# Altium schematic sheet Piksi.SchDoc
size B
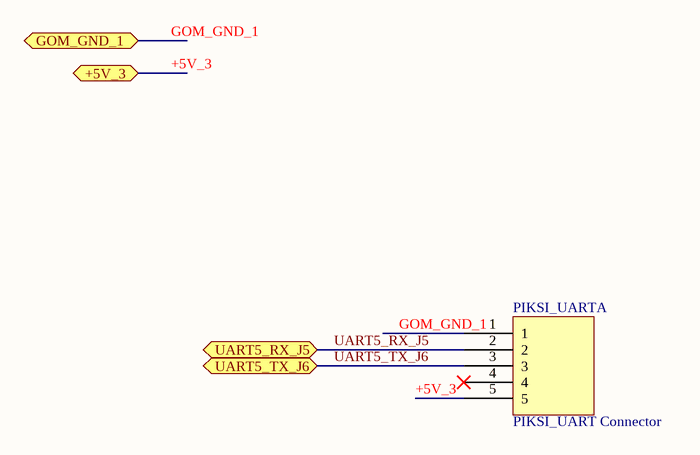
[diagram p0: Piksi.SchDoc]

## Parts
PIKSI_UARTA  PIKSI_UART Connector  [Molex Picoblade 5 Pin]

## Ports
+5V_3 (bidir), GOM_GND_1 (bidir), UART5_RX_J5 (bidir), UART5_TX_J6 (bidir)

## Nets
+5V_3: PIKSI_UARTA.5 ; port +5V_3
GOM_GND_1: PIKSI_UARTA.1 ; port GOM_GND_1
UART5_RX_J5: PIKSI_UARTA.2 ; port UART5_RX_J5
UART5_TX_J6: PIKSI_UARTA.3 ; port UART5_TX_J6

Not connected (* = marked no-connect by the designer): PIKSI_UARTA 4*

## Library data of the parts
PIKSI_UARTA = PIKSI_UART Connector: Molex Picoblade 53261-0571